# EasyEDA schematic SCH_URC-VPN-New-Project_2025-07-22 (1).json
TITLE: Sheet_1; REV: 1.0; Date: 2025-07-02; Sheet: 1/1; Drawn By: b24297; Company: Your Company
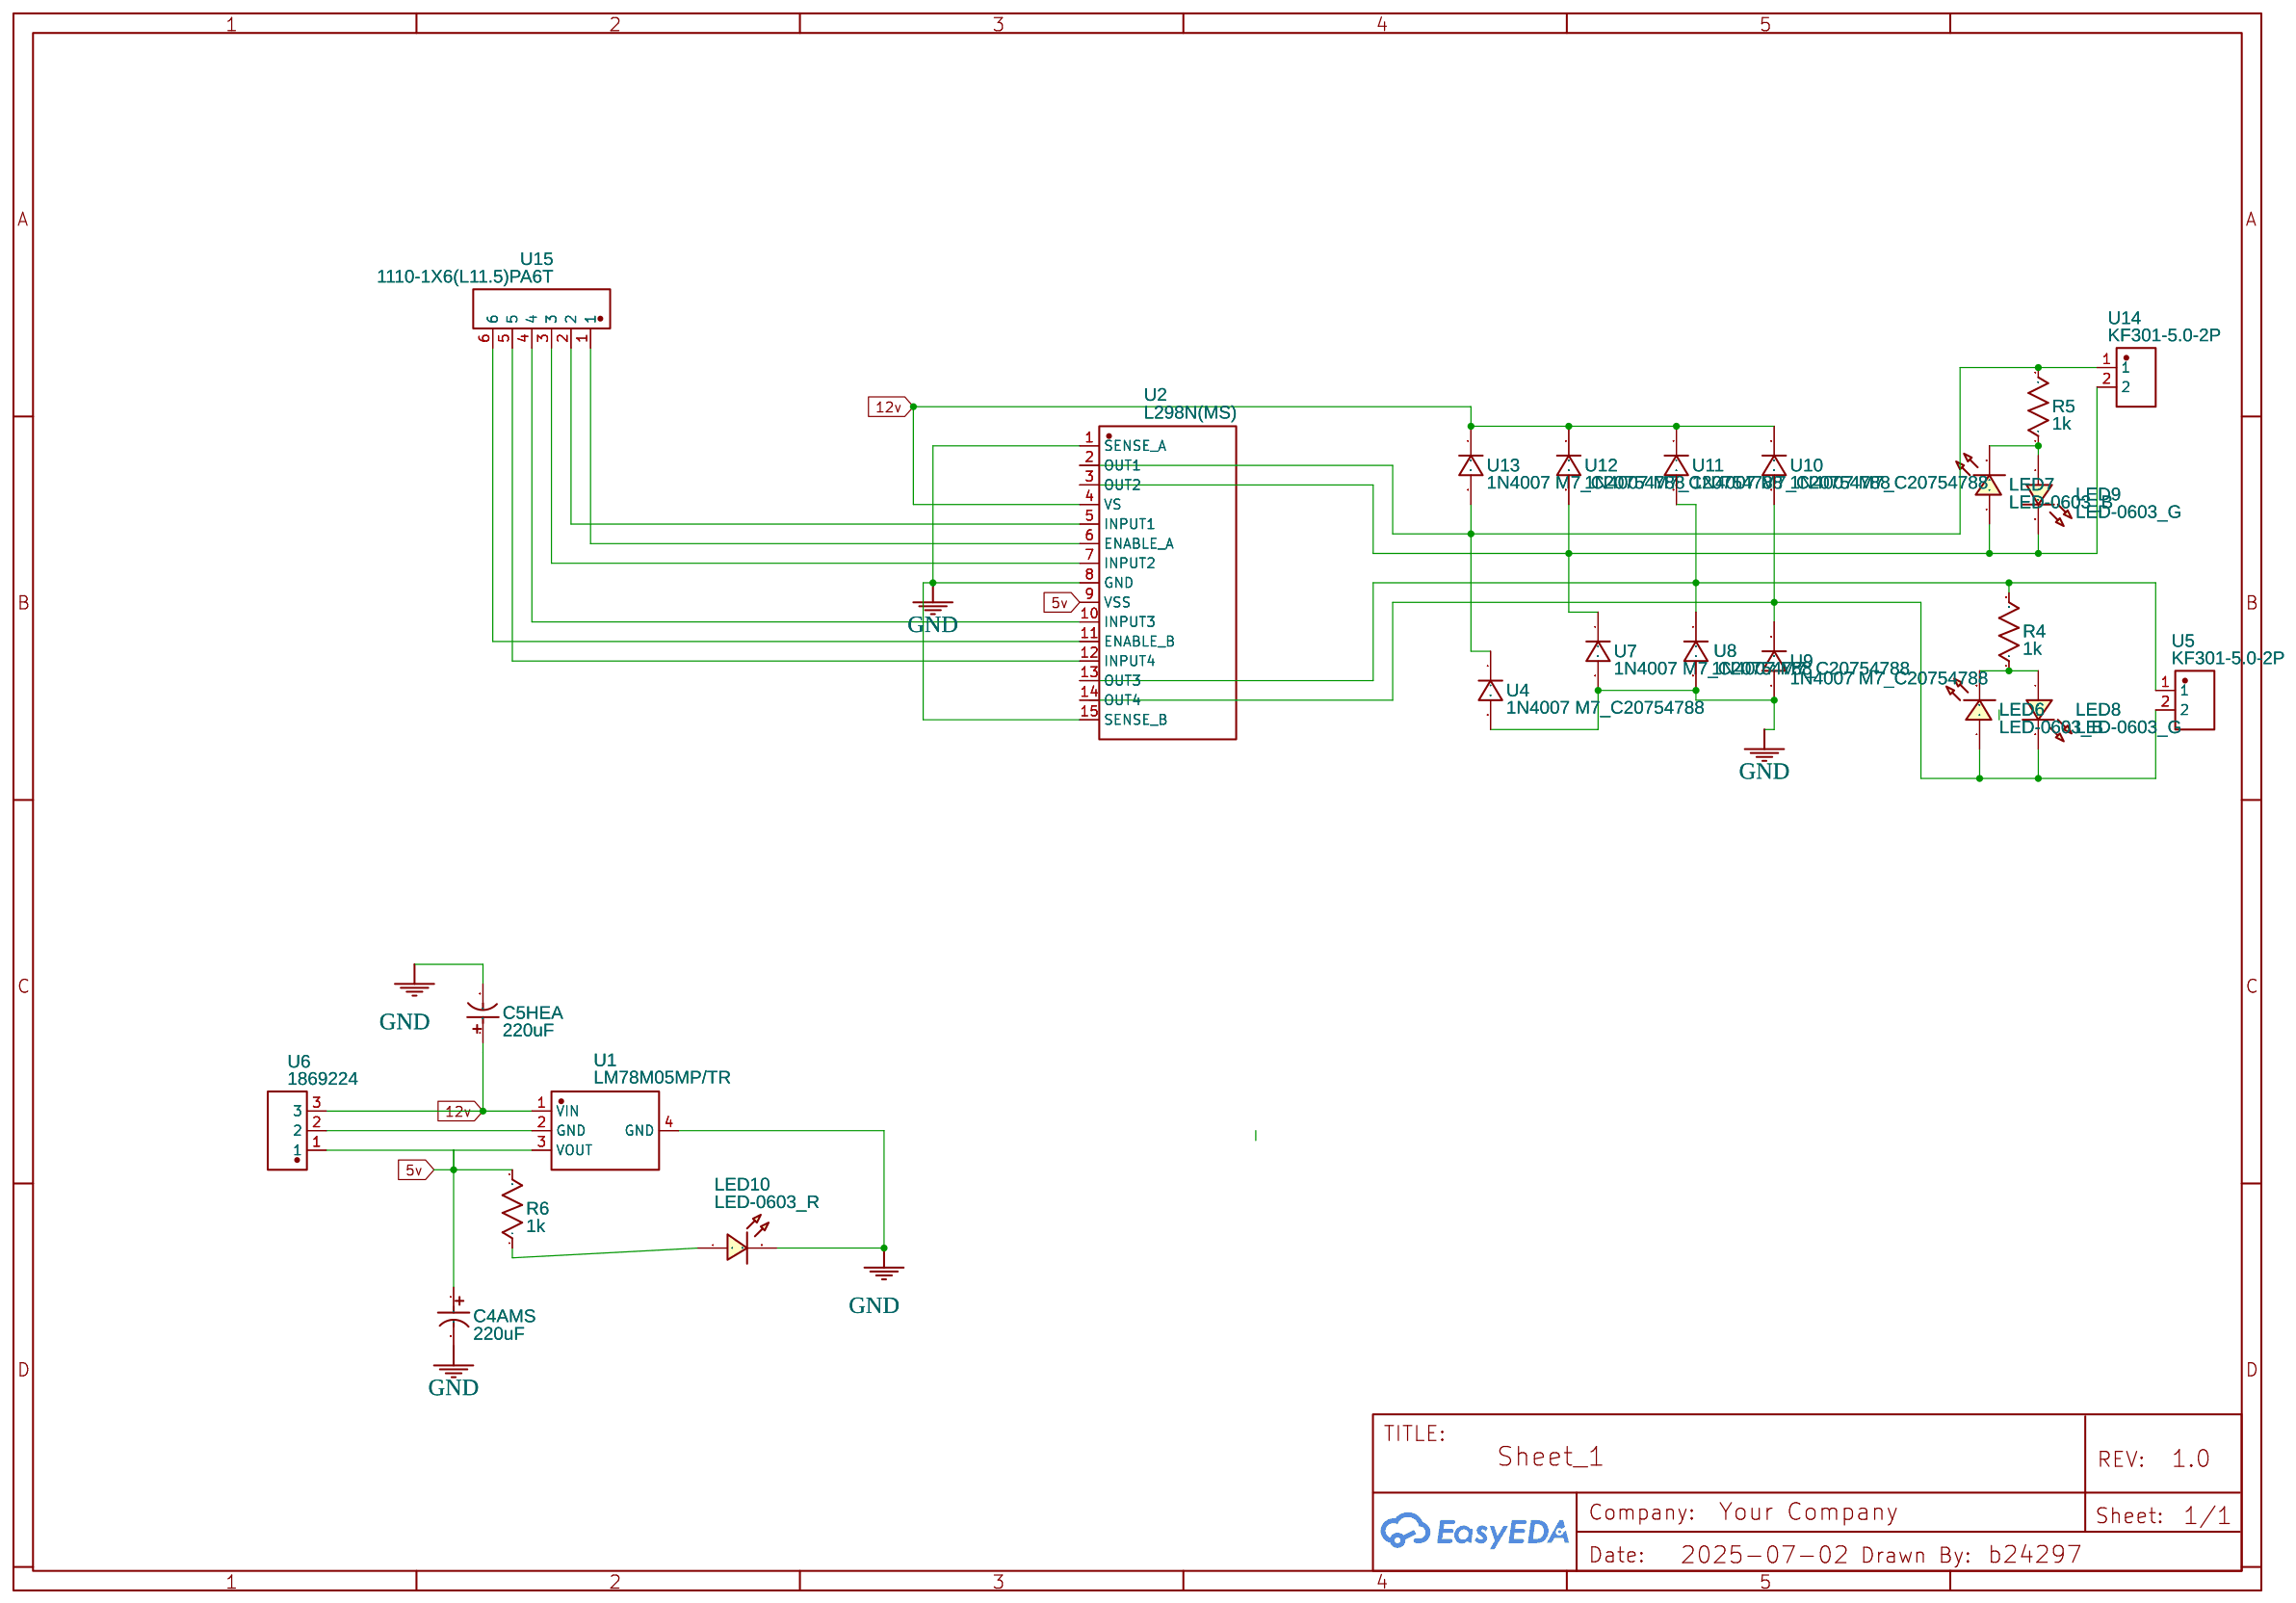
[diagram p0: schematic sheet]

## Parts
C4AMS  220uF  [CAP-TH_BD8.0-P3.50-D0.6-FD]
C5HEA  220uF  [CAP-TH_BD8.0-P3.50-D0.6-FD]
LED6  LED-0603_B  [LED0603_BLUE]
LED7  LED-0603_B  [LED0603_BLUE]
LED8  LED-0603_G  [LED0603_GREEN]
LED9  LED-0603_G  [LED0603_GREEN]
LED10  LED-0603_R  [LED0603_RED]
R4  1k  [R0603]
R5  1k  [R0603]
R6  1k  [R0603]
U1  LM78M05MP/TR  [SOT-223-4_L6.5-W3.5-P2.30-LS7.0-BR]
U2  L298N(MS)  [MULTIWATT-15_L19.6-W5.0-P1.27-L]
U4  1N4007 M7_C20754788  [SMA_L4.4-W2.8-LS5.4-RD]
U5  KF301-5.0-2P  [CONN-TH_P5.00_KF301-5.0-2P]
U6  1869224  [CONN-TH_3P-P5.08_1869224]
U7  1N4007 M7_C20754788  [SMA_L4.4-W2.8-LS5.4-RD]
U8  1N4007 M7_C20754788  [SMA_L4.4-W2.8-LS5.4-RD]
U9  1N4007 M7_C20754788  [SMA_L4.4-W2.8-LS5.4-RD]
U10  1N4007 M7_C20754788  [SMA_L4.4-W2.8-LS5.4-RD]
U11  1N4007 M7_C20754788  [SMA_L4.4-W2.8-LS5.4-RD]
U12  1N4007 M7_C20754788  [SMA_L4.4-W2.8-LS5.4-RD]
U13  1N4007 M7_C20754788  [SMA_L4.4-W2.8-LS5.4-RD]
U14  KF301-5.0-2P  [CONN-TH_P5.00_KF301-5.0-2P]
U15  1110-1X6(L11.5)PA6T  [HDR-TH_6P-P2.54-H-M-W8.0]

## Library data of the parts
C4AMS C5HEA = 220uf/35V: Supplier: LCSC; Manufacturer: CX(承兴); Manufacturer Part: KM227M035F12RR0VH2FP0; Supplier Part: C2063; JLCPCB Part Class: Extended Part
LED6 LED7 = LED-0603_B: Manufacturer: EVERLIGHT(台湾亿光); Manufacturer Part: 19-217/BHC-ZL1M2RY/3T; Supplier Part: C72041; Supplier: LCSC; Contributor: LCEDA_01
LED8 LED9 = LED-0603_G: Manufacturer: EVERLIGHT(台湾亿光); Manufacturer Part: 19-217/GHC-YR1S2/3T; Supplier Part: C72043; Supplier: LCSC; Contributor: LCEDA_Lib
LED10 = LED-0603_R: Manufacturer: EVERLIGHT(台湾亿光); Manufacturer Part: 19-217/R6C-AL1M2VY/3T; Supplier Part: C72044; Supplier: LCSC; Contributor: LCEDA_01
R4-R6 = R_0603_US: Contributor: LCEDA_Lib
U1 = LM78M05MP/TR: Supplier: LCSC; Supplier Part: C19193458; Manufacturer: HGSEMI(华冠); JLCPCB Part Class: Extended Part; Contributor: lcsc
U2 = L298N(MS): Supplier: LCSC; Supplier Part: C19632282; Manufacturer: MSKSEMI(美森科); Contributor: lcsc; JLCPCB Part Class: Extended Part
U4 U7-U13 = 1N4007 M7_C20754788: Supplier: LCSC; Supplier Part: C20754788; Manufacturer: JSMSEMI(杰盛微); Manufacturer Part: 1N4007 M7; Contributor: lcsc; JLCPCB Part Class: Extended Part
U5 U14 = KF301-5.0-2P: Contributor: LCSC; Supplier: LCSC; Supplier Part: C474881; Manufacturer: KEFA(科发); JLCPCB Part Class: Extended Part
U6 = 1869224: Supplier: LCSC; Supplier Part: C5490320; Manufacturer: Phoenix Contact(菲尼克斯); JLCPCB Part Class: Extended Part; Contributor: lcsc
U15 = 1110-1X6(L11.5)PA6T: Supplier: LCSC; Supplier Part: C18214186; Manufacturer: CST(永丰盈); Manufacturer Part: 1110-1x6(L11.5)PA6T; Contributor: lcsc; JLCPCB Part Class: Extended Part

## Nets
5v: C4AMS.1 R6.2 U1.3(VOUT) U2.9(VSS) U6.1
12v: C5HEA.1 U1.1(VIN) U2.4(VS) U6.3 U10.1 U11.1 U12.1 U13.1
GND: C4AMS.2 C5HEA.2 LED10.2 U1.4(GND) U2.1(SENSE A) U2.8(GND) U2.15(SENSE B) U4.2 U7.2 U8.2 U9.2
Net-(LED6-1): LED6.1 LED8.2 U5.2 U9.1 U10.2
Net-(LED6-2): LED6.2 LED8.1 R4.1
Net-(LED7-1): LED7.1 LED9.2 U2.3(OUT2) U7.1 U12.2 U14.2
Net-(LED7-2): LED7.2 LED9.1 R5.1
Net-(LED10-1): LED10.1 R6.1
Net-(R4-2): R4.2 U2.13(OUT3) U5.1 U8.1 U11.2
Net-(R5-2): R5.2 U2.2(OUT1) U4.1 U13.2 U14.1
Net-(U1-2): U1.2(GND) U6.2
Net-(U2-5): U2.5(INPUT1) U15.2
Net-(U2-6): U2.6(ENABLE A) U15.1
Net-(U2-7): U2.7(INPUT2) U15.3
Net-(U2-10): U2.10(INPUT3) U15.4
Net-(U2-11): U2.11(ENABLE B) U15.6
Net-(U2-12): U2.12(INPUT4) U15.5

Not connected (* = marked no-connect by the designer): U2 14(OUT4)
